# EAGLE design ESP32 Touch_Indoor Environment Expansion v1.1 (EAGLE 6.1)
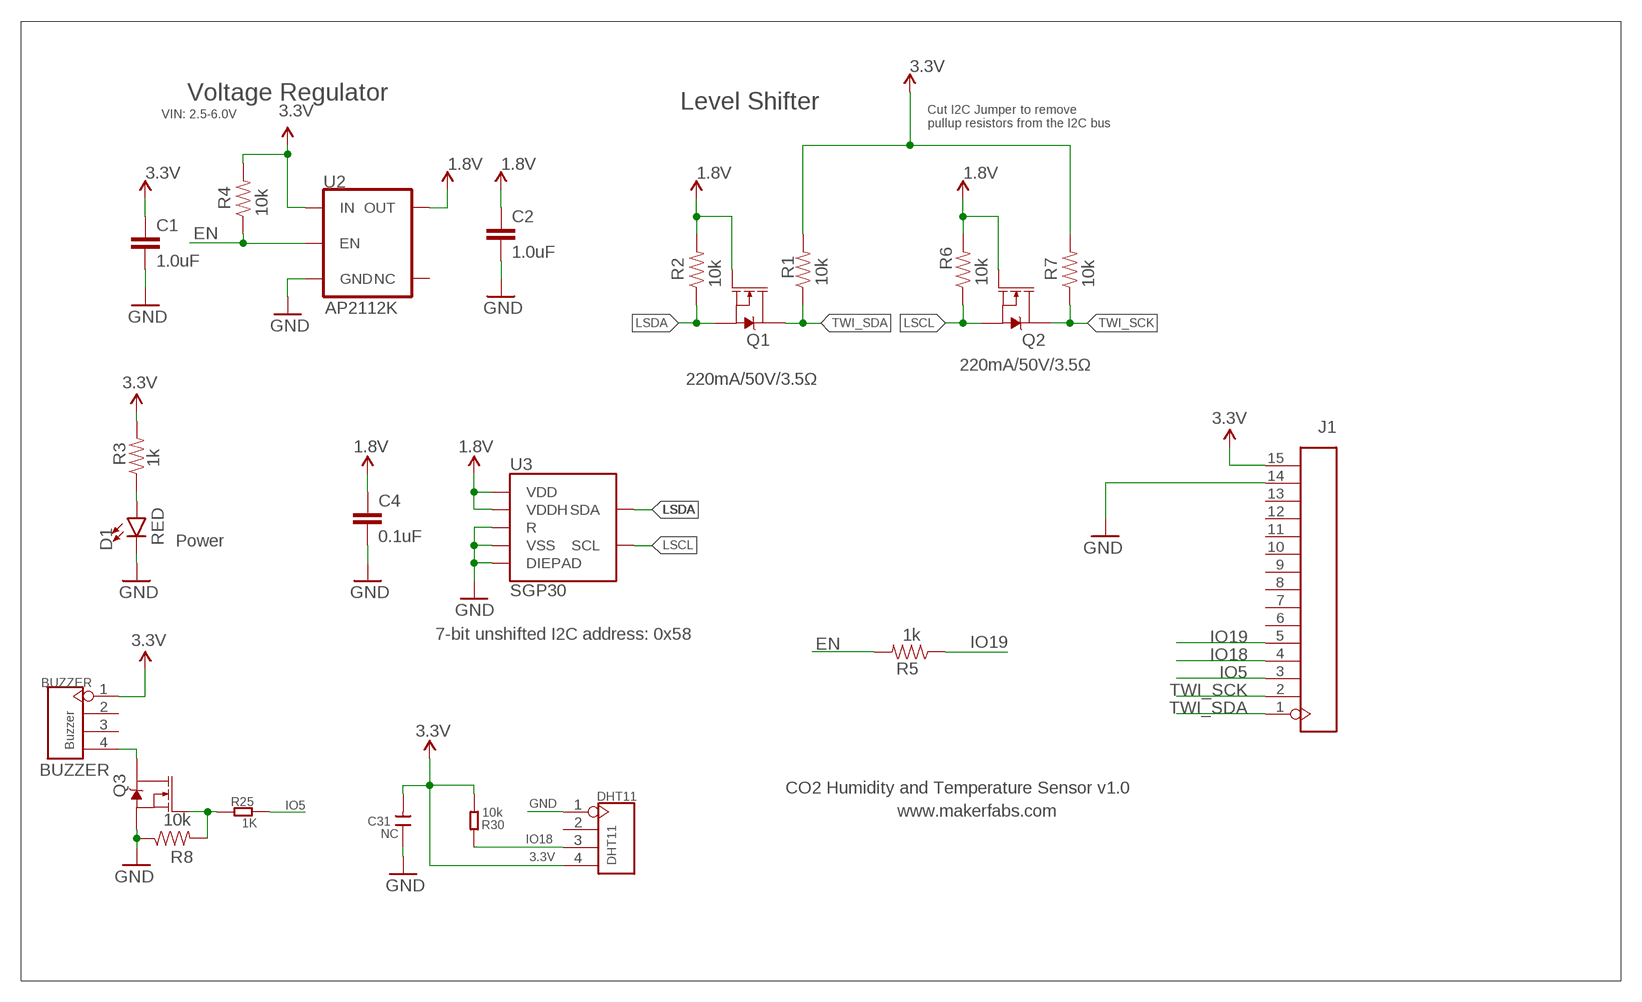
[diagram p0: schematic, sheet 1]

## Parts
BUZZER  Buzzer  HEADER-4P-60/35MILROUND  [4P-65/35ROUND]
C1  1.0uF  1.0UF-0603-16V-10%  [0603]
C2  1.0uF  1.0UF-0603-16V-10%  [0603]
C4  0.1uF  0.1UF-0603-25V-(+80/-20%)  [0603]
C31  NC  C-0603  [0603]
D1  RED  LED-RED0603  [LED-0603]
DHT11  DHT11  HEADER-4P-60/35MILROUND  [4P-65/35ROUND]
J1  HEADER-1X15P3  [DIP-1X15-2.54MM-W]
Q1  220mA/50V/3.5Ω  MOSFET-NCH-BSS138  [SOT23-3]
Q2  220mA/50V/3.5Ω  MOSFET-NCH-BSS138  [SOT23-3]
Q3  220mA/50V/3.5Ω  MOSFET-NCH-BSS138  [SOT23-3]
R1  10k  10KOHM-0603-1/10W-1%  [0603]
R2  10k  10KOHM-0603-1/10W-1%  [0603]
R3  1k  1KOHM-0603-1/10W-1%  [0603]
R4  10k  10KOHM-0603-1/10W-1%  [0603]
R5  1k  1KOHM-0603-1/10W-1%  [0603]
R6  10k  10KOHM-0603-1/10W-1%  [0603]
R7  10k  10KOHM-0603-1/10W-1%  [0603]
R8  10k  10KOHM-0603-1/10W-1%  [0603]
R25  1K  R-0603  [R0603]
R30  10k  R-0603  [R0603]
U2  AP2112K  V_REG_AP2112K-3.3V  [SOT23-5]
U3  SGP30  [SGP30]

## Nets
1.8V: C2.1 C4.1 Q1.1(G) Q2.1(G) R2.2 R6.2 U2.5(OUT) U3.1(VDD) U3.5(VDDH)
3.3V: BUZZER.1 C1.1 C31.2 DHT11.4 J1.15 R1.2 R3.2 R4.2 R7.2 R30.2 U2.1(IN)
EN: R4.1 R5.2 U2.3(EN)
GND: C1.2 C2.2 C4.2 C31.1 D1.C DHT11.1 J1.14 Q3.2(S) R8.1 U2.2(GND) U3.2(VSS) U3.4(R) U3.DIEPAD
IO5: J1.3 R25.1
IO18: DHT11.3 J1.4 R30.1
IO19: J1.5 R5.1
LSCL: Q2.2(S) R6.1 U3.6(SCL)
LSDA: Q1.2(S) R2.1 U3.3(SDA)
N$1: BUZZER.4 Q3.3(D)
N$2: Q3.1(G) R8.2 R25.2
N$3: D1.A R3.1
TWI_SCK: J1.2 Q2.3(D) R7.1
TWI_SDA: J1.1 Q1.3(D) R1.1
Unconnected: BUZZER.2 BUZZER.3 DHT11.2 J1.6 J1.7 J1.8 J1.9 J1.10 J1.11 J1.12 J1.13 U2.4(NC)

## Notes on the sheet
- Voltage Regulator
- Level Shifter
- VIN: 2.5-6.0V
- Cut I2C Jumper to remove 
  pullup resistors from the I2C bus
- Power
- 7-bit unshifted I2C address: 0x58
- BUZZER
- CO2 Humidity and Temperature Sensor v1.0
- www.makerfabs.com

## Library data of the parts
BUZZER DHT11 = Connector:HEADER-4P
C1 C2 = SparkFun-Capacitors:1.0UF: 1µF ceramic capacitors A capacitor is a passive two-terminal electrical component used to store electrical energy temporarily in an electric field.; PROD_ID: CAP-00868
C4 = SparkFun-Capacitors:0.1UF: 0.1µF ceramic capacitors A capacitor is a passive two-terminal electrical component used to store electrical energy temporarily in an electric field.; PROD_ID: CAP-00810
C31 = Discrete:C*: Ceramic Capacitors
D1 = SparkFun-LED:LED-RED: Red SMD LED Used in manufacturing of most products at SparkFun Packages: 0603 - SMD 0603 package [Product Link] <http://docs.avagotech.com/docs/AV02-0551EN> 0603 SMART - SMD 0603 SMART package ( more efficient and expensive)[Product Link] <http://www.osram-os.com/Graphics/XPic2/00077099_0.pdf> 1206 - SMD1206 package [Product Link] <https://www.sparkfun.com/datasheets/DevTools/LilyPad/Q150OVS4.pdff> SparkFun Products: Pro Mini 328 -5V <https://www.sparkfun.com/products/821> RedBoard <https://www.sparkfun.com/products/12757> IOIO-OTG <https://www.sparkfun.com/products/13613>; PROD_ID: DIO-00819
J1 = self:HEADER-1X15P
Q1-Q3 = SparkFun-DiscreteSemi:MOSFET-NCH: N-channel MOSFETs Voltage controlled devices that allow control of high current outputs. SparkFun Products: SparkFun OpenScale <https://www.sparkfun.com/products/13261> SparkFun Digital Sandbox <https://www.sparkfun.com/products/12651> SparkFun Monster Moto Shield <https://www.sparkfun.com/products/10182> SparkFun MOSFET Power Controller <https://www.sparkfun.com/products/11214>; PROD_ID: TRANS-00830
R1 R2 R4 R6-R8 = SparkFun-Resistors:10KOHM: 10kΩ resistor A resistor is a passive two-terminal electrical component that implements electrical resistance as a circuit element. Resistors act to reduce current flow, and, at the same time, act to lower voltage levels within circuits. - Wikipedia; PROD_ID: RES-00824
R3 R5 = SparkFun-Resistors:1KOHM: 1kΩ resistor A resistor is a passive two-terminal electrical component that implements electrical resistance as a circuit element. Resistors act to reduce current flow, and, at the same time, act to lower voltage levels within circuits. - Wikipedia; PROD_ID: RES-07856
R25 R30 = Discrete:R*
U2 = SparkFun-IC-Power:V_REG_AP2112: AP2112 - 600mA CMOS LDO Regulator w/ Enable The AP2112 is CMOS process low dropout linear regulator with enable function, the regulator delivers a guaranteed 600mA (min.) continuous load current. Features Output Voltage Accuracy: ±1.5% Output Current: 600mA (Min.) Foldback Short Current Protection: 50mA Enable Function to Turn ON/OFF VOUT Low Dropout Voltage (3.3V): 250mV (Typ.) @IOUT=600mA Excellent Load Regulation: 0.2%/A (Typ.) Excellent Line Regulation: 0.02%/V (Typ.) Low Quiescent Current: 55μA (Typ.) Low Standby Current: 0.01μA (Typ.) Low Output Noise: 50μVRMS PSRR: 100Hz -65dB, 1kHz -65dB OTSD Protection Stable with 1.0μF Flexible Cap: Ceramic, Tantalum and Aluminum Electrolytic Operation Temperature Range: -40°C to 85°C ESD: MM 400V, HBM 4000V; PROD_ID: VREG-12457; VALUE: 3.3V
U3 = SparkFun-Sensors:SGP30: The SGP30 is a digital multi-pixel gas sensor designed for easy integration into air purifier, demand-controlled ventilation, and IoT applications.; PROD_ID: IC-14776

## Net classes
0 default: width 0.203 mm, drill 0.305 mm, clearance 0.152 mm
2 gnd: width 0.305 mm, drill 0.559 mm, clearance 0.254 mm
3 usbvcc: width 0.508 mm, drill 0.61 mm, clearance 0.254 mm

## Board
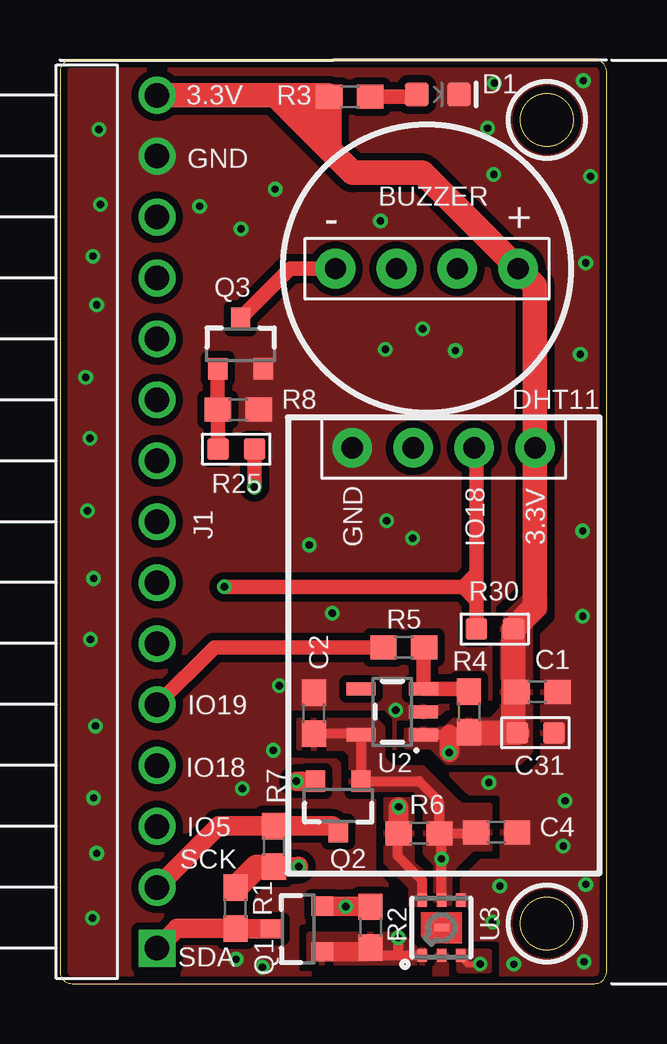
[diagram p1: board, top side]
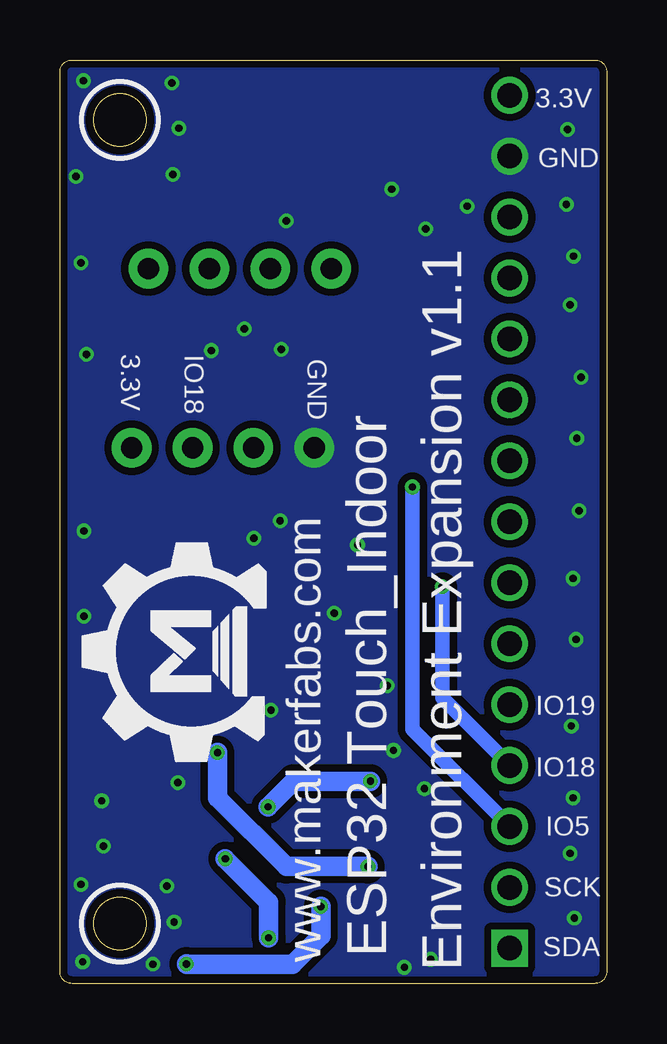
[diagram p2: board, bottom side, seen from below]

Size 22.8 x 38.5 mm. Coordinates in mm from the lower left corner, seen from the top.
Outline: 0,38 0,0.5 arc90 0.5,0 22.3,0 arc90 22.8,0.5 22.8,38 arc90 22.3,38.5 0.5,38.5 arc90 0,38
Outline: circle at 20.3,2.5 radius 1.1
Outline: circle at 20.3,36 radius 1.1
Copper layers (1*16): Top 0.035mm / dielectric 1.5mm / Bottom 0.035mm
Design rules: minimum track width 6mil, minimum drill 12mil, track to track 6mil, track to pad 6mil, pad to pad 6mil, via to via 6mil, smd to smd 0mil, copper to edge 10mil, drill to drill 10mil, minimum pad ring 10mil, minimum via ring 6mil, stop-mask expansion 2mil, vias tented up to drill 100mil, thermal gap 0mil

### Footprints (pad centres in the part's own frame; a part is rotated, then mirrored left to right if it is on the bottom)
4P-65/35ROUND = drill 0.889 pad 1.651: 1 0,3.81; 2 0,1.27; 3 0,-1.27; 4 0,-3.81
0603 = smd 1.1 x 1: 1 -0.85,0; 2 0.85,0
0603' = smd 0.889 x 0.889: 1 -0.762,0; 2 0.762,0
LED-0603 = smd 1 x 1: A -0.877,0; C 0.877,0
DIP-1X15-2.54MM-W = drill 1.02 square: 1 -17.78,0 | drill 1.02: 2 -15.24,0; 3 -12.7,0; 4 -10.16,0; 5 -7.62,0; 6 -5.08,0; 7 -2.54,0; 8 0,0; 9 2.54,0; 10 5.08,0; 11 7.62,0; 12 10.16,0; 13 12.7,0; 14 15.24,0; 15 17.78,0
SOT23-3 = smd 0.8 x 0.9: 1 -0.95,-1; 2 0.95,-1; 3 0,1.1
R0603 = smd 0.889 x 0.889: 1 -0.762,0; 2 0.762,0
SOT23-5 = smd 0.55 x 1.2: 1 -0.95,-1.3; 2 0,-1.3; 3 0.95,-1.3; 4 0.95,1.3; 5 -0.95,1.3
SGP30 = smd 0.55 x 0.4: 1 -1.15,0.8; 2 -1.15,0; 3 -1.15,-0.8; 4 1.15,-0.8; 5 1.15,0; 6 1.15,0.8 | smd 0.305 x 0.61: DIEPAD 0,0

### Placement (x,y rotation side)
BUZZER  15.3,29.8 270 top
C1  19.9,12.16 0 top
C2  10.59,11.27 90 top
C4  18.2,6.31 0 top
C31  NC  [0603']  19.83,10.45 180 top
D1  15.76,37.06 0 top
DHT11  16,22.33 90 top
J1  4.05,19.25 90 top
Q1  9.94,2.28 90 top
Q2  11.61,7.43 180 top
Q3  7.53,26.63 0 top
R1  7.32,3.15 90 top
R2  12.95,2.35 270 top
R3  12.09,36.97 180 top
R4  17.05,11.32 270 top
R5  14.34,14.02 0 top
R6  14.97,6.27 0 top
R7  8.92,5.72 270 top
R8  7.44,23.93 180 top
R25  7.35,22.27 180 top
R30  18.13,14.78 0 top
U2  13.86,11.33 90 top
U3  15.91,2.33 90 top
U$1  [MAKERFABS_0.3]  14.25,9.72 90 bottom

### Tracks (layer width: path | path; a pad name or v marks a point on that pad's centre or on a via)
1.8V  (via drill 0.3)
  Top 0.406: U3.5 v15.91,5.2 15.91,6.18 R6.2 | R6.2 17.31,6.27 C4.1 | C2.1 12.51,10.42 U2.5 Q2.1 | Q2.1 | Q2.1 14.97,8.43 15.8,7.6 15.8,6.29 R6.2 | R2.2 13.27,1.18 14.1,1.18 | 14.1,1.18 U3.1 | v14.1,1.91 14.1,1.18
  Top 0.813: R2.2 12.78,1.33 Q1.1
  Bottom 0.813: v14.1,1.91 14.1,3.39 v15.91,5.2
  pour Top: 10.41,2.06 14.2,2.06 14.78,1.47 14.86,1.4 15.19,1.4 15.19,0.86 10.41,0.86
  pour Top: 9.98,10.97 13.16,10.97 13.44,10.69 13.44,9.4 13.84,8.99 15.11,8.99 16.41,7.7 16.69,7.42 17.91,7.42 17.91,5.61 17.17,5.61 16.23,4.67 16.23,3.33 15.7,3.33 15.7,4.98 15.27,5.41 15.27,7.65 14.81,8.1 12.17,8.1 12.17,9.53 11.89,9.8 9.98,9.8
3.3V  (via drill 0.3)
  Top 0.406: U2.1 16.23,10.38 16.95,10.38 R4.2
  Top 0.813: R7.2 9.95,4.87 v9.96,4.88 | v16.23,9.63 16.23,10.38
  Top 1.016: R4.2 17.07,10.45 C31.2 18.9,10.62 18.9,12.1 | 18.9,12.1 R30.2 19.81,15.69 DHT11.4 19.81,29.1 BUZZER.1 15.11,33.8 12.2,33.8 11.24,34.76 | C1.1 18.95,12.16 18.9,12.1 | J1.15 11.18,37.03 R3.2 11.24,34.76 | R1.2 8.19,4.87 R7.2 | 11.24,34.76 8.99,37.01 10.06,37.01 11.2,35.87 | 11.66,34.34 11.24,34.76 | 11.24,34.76
  Bottom 0.813: v9.96,4.88 13.36,4.88 16.23,7.75 v16.23,9.63
  pour Top: 14.48,10.62 16.08,10.62 16.46,11 17.98,11 18.47,11.48 18.47,15.21 19.35,16.1 20.19,16.1 20.19,15.52 19.58,14.91 19.58,9.65 19.15,9.22 16.15,9.22 15.52,9.86 14.48,9.86
EN
  Top 0.61: R4.1 16.95,12.28 U2.3 15.16,13.98 R5.2
GND  (via drill 0.3)
  other vias: 18.13,37.54 22.13,33.64 5.82,32.4 13.57,26.43 16.49,26.38 13.37,31.79 18.09,33.72 7.55,31.46 1.63,35.6 1.38,30.32 1.07,25.27 1.15,19.7 1.28,14.34 1.4,7.74 1.35,2.74 7.35,1.01 8.44,0.68 7.6,8.12 9.15,12.41 14,11.4 21.8,18.86 21.8,15.31 14.71,18.56 10.39,18.28 13.62,19.3 21.06,7.61 20.99,5.73 18.04,2.56 18.34,4.06 17.89,8.37 11.36,15.44 1.53,5.43 1.48,10.74 1.4,16.88 1.25,22.73 1.53,28.29 1.68,32.48 8.97,33.11 15.12,27.3 21.93,30.04 21.7,26.23 17.84,35.65 21.82,37.64 21.85,0.91 18.93,0.81 21.93,4.13 8.9,9.72
  pour Bottom (isolate 0.305, rank 6): -3,-1 35,-1 35,40 -3,40
  pour Top (isolate 0.305, rank 6): -2,-1 35,-1 35,40 -2,40
IO5  (via drill 0.3)
  Top 0.61: R25.1 8.11,20.71 v8.1,20.7
  Bottom 0.61: J1.3 8.1,10.6 v8.1,20.7
IO18  (via drill 0.3)
  Top 0.61: R30.1 17.37,15.98 | 17.37,15.98 17.37,22.23 DHT11.3 | v6.86,16.54 16.81,16.54 | 16.81,16.54 17.37,15.98 | 16.81,16.54 16.82,16.54 17.35,17.07
  Bottom 0.61: J1.4 6.86,11.9 v6.86,16.54
IO19
  Top 0.61: R5.1 6.44,14.02 J1.5
LSCL  (via drill 0.3)
  Top 0.406: U3.6 15.11,4.29 14.1,5.3 14.1,6.24 R6.1
  Top 0.813: Q2.2 v9.86,8.43 | v14.12,7.37 R6.1
  Bottom 0.813: v9.86,8.43 13.06,8.43 v14.12,7.37
  pour Top: 13.59,7.52 13.59,5.08 14.63,4.04 14.63,3.33 15.19,3.33 15.19,4.55 14.68,5.05 14.68,7.57 14.68,7.65 13.59,7.65
LSDA  (via drill 0.3)
  Top 0.254: U3.3 16.71,1.09 17,0.8 17.51,0.8 v17.53,0.81
  Top 0.813: Q1.2 10.95,3.21 v11.92,3.21 12.93,3.21 R2.1
  Bottom 0.813: v11.92,3.21 11.92,1.98 13.1,0.8 16.66,0.8 17,0.8 17.51,0.8 v17.53,0.81
  pour Top: 17.91,1.32 16.64,1.32 16.64,0.69 16.64,0.56 17.91,0.56
N$1
  Top 0.61: BUZZER.4 9.6,29.8 Q3.3
N$2
  Top 0.61: Q3.1 R8.2 R25.2
N$3
  Top 0.61: R3.1 14.79,36.97 D1.A
TWI_SCK
  Top 0.813: Q2.3 11.37,6.57 R7.1 6.61,6.57 J1.2
TWI_SDA
  Top 0.813: Q1.3 7.33,2.28 R1.1 4.88,2.29 J1.1

### Text on the board
tPlace: 3.3V | GND | - | + | GND | IO18 | 3.3V | IO19 | IO18 | IO5 | SCK | SDA
bPlace: 3.3V | GND | GND | IO18 | 3.3V | IO19 | IO18 | IO5 | SCK | SDA | Environment Expansion v1.1 | ESP32 Touch_Indoor | www.makerfabs.com